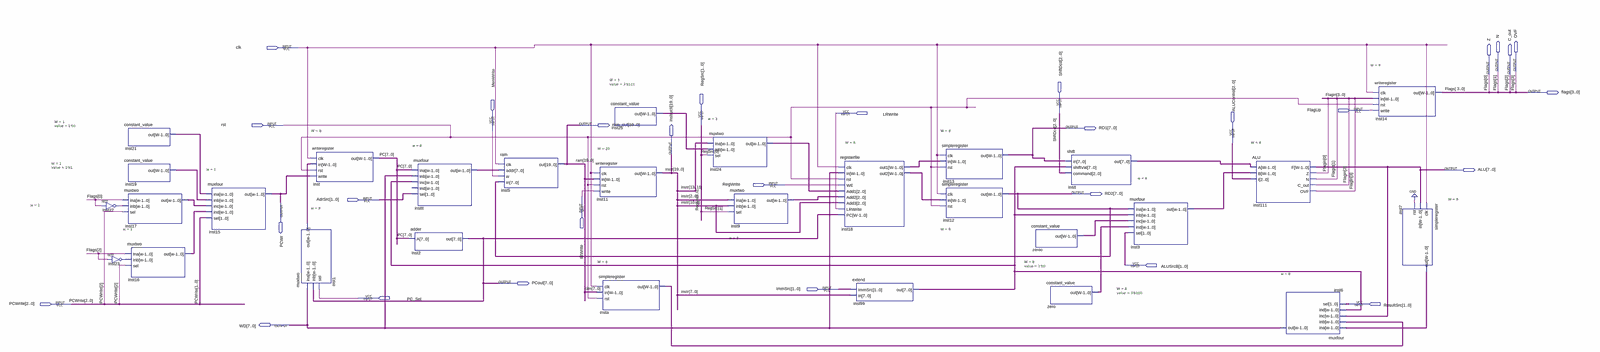
[diagram p0: schematic sheet, whole]
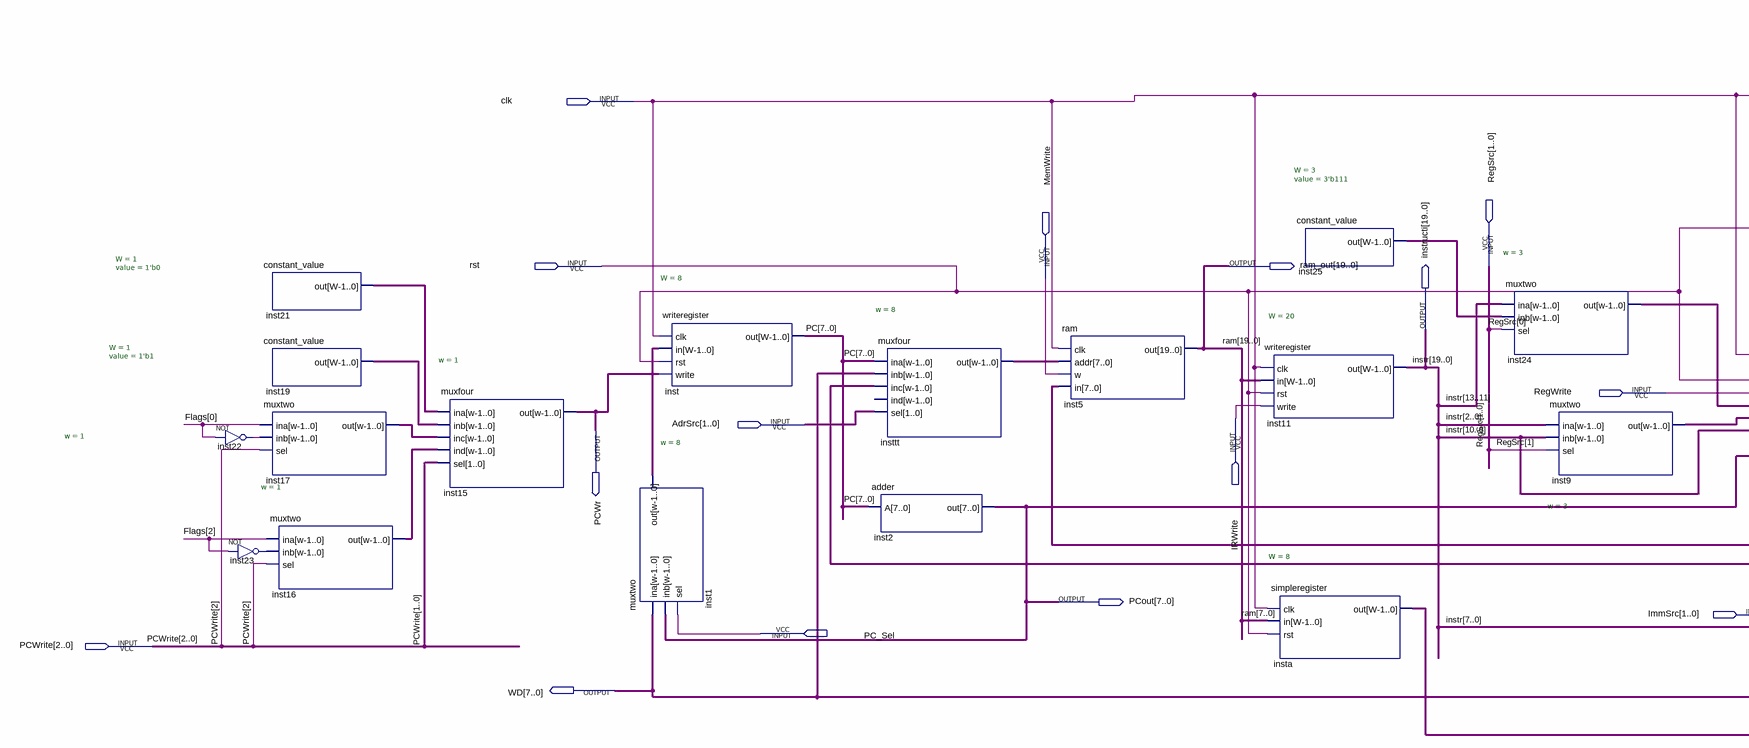
[diagram p1: schematic sheet, left part]
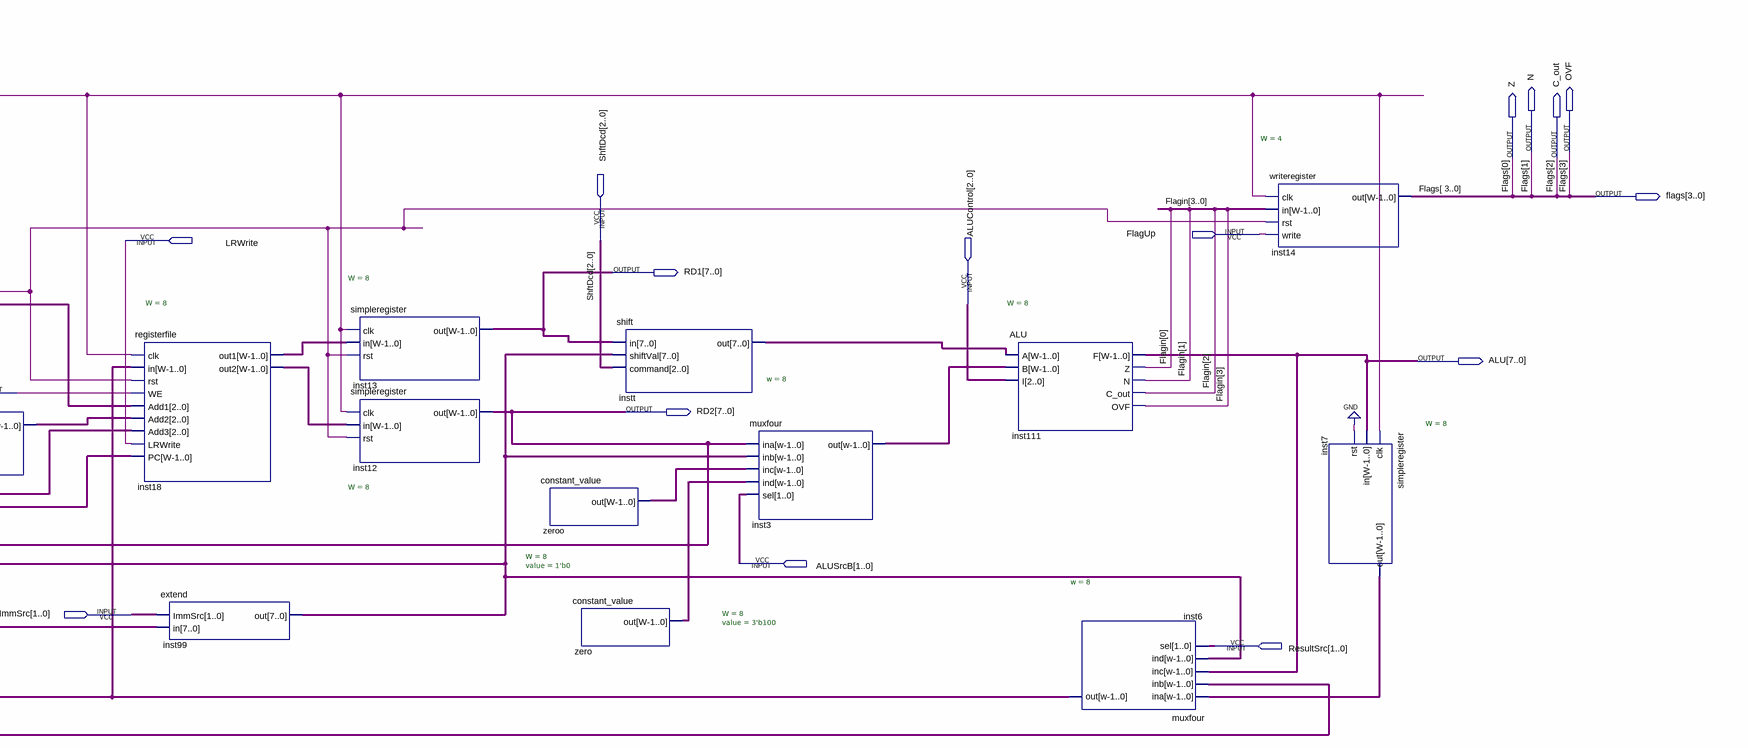
[diagram p2: schematic sheet, right part]
// Quartus schematic fourthData.bdf as structural Verilog: 29 symbols, 29 pins
module fourthData (
  input  clk,
  input  FlagUp,
  input  LRWrite,
  input  [2:0] ShftDcd,
  input  rst,
  input  [1:0] RegSrc,
  input  MemWrite,
  input  [2:0] ALUControl,
  input  RegWrite,
  input  IRWrite,
  input  [1:0] AdrSrc,
  input  [1:0] ALUSrcB,
  input  [1:0] ImmSrc,
  input  PC_Sel,
  input  [2:0] PCWrite,
  input  [1:0] ResultSrc,
  output N,
  output OVF,
  output Z,
  output C_out,
  output [3:0] flags,
  output [19:0] ram_out,
  output [7:0] RD1,
  output [19:0] instructi,
  output [7:0] ALU,
  output [7:0] RD2,
  output PCWr,
  output [7:0] PCout,
  output [7:0] WD
);

  wire inst16_out, inst17_out, inst19_out, inst21_out, inst22_out, inst23_out;
  wire [2:0] inst9_out, inst24_out, inst25_out;
  wire [3:0] Flagin;
  wire [7:0] inst1_out, inst3_out, inst7_out, inst18_out1, inst18_out2, inst99_out, insta_out, instt_out,
       insttt_out, PC, zero_out, zeroo_out;

  not inst22 (inst22_out, flags[0]);
  constant_value #(.W(1), .value(1'b0)) inst21 (.out(inst21_out));
  constant_value #(.W(1), .value(1'b1)) inst19 (.out(inst19_out));
  muxtwo #(.w(1)) inst17 (.ina(flags[0]), .inb(inst22_out), .sel(PCWrite[2]), .out(inst17_out));
  muxtwo #(.w(1)) inst16 (.ina(C_out), .inb(inst23_out), .sel(PCWrite[2]), .out(inst16_out));
  not inst23 (inst23_out, C_out);
  muxfour #(.w(1)) inst15 (
    .ina(inst21_out), .inb(inst19_out), .inc(inst17_out), .ind(inst16_out), .sel(PCWrite[1:0]), .out(PCWr));
  writeregister #(.W(8)) inst (.clk(clk), .in(inst1_out), .rst(rst), .write(PCWr), .out(PC));
  muxtwo #(.w(8)) inst1 (.ina(WD), .inb(PCout), .sel(PC_Sel), .out(inst1_out));
  muxfour #(.w(8)) insttt (.ina(PC), .inb(WD), .inc(inst99_out), .sel(AdrSrc), .out(insttt_out));  // open: ind
  adder inst2 (.A(PC), .out(PCout));
  ram inst5 (.clk(clk), .addr(insttt_out), .w(MemWrite), .in(RD2), .out(ram_out));
  writeregister #(.W(20)) inst11 (.clk(clk), .in(ram_out), .rst(rst), .write(IRWrite), .out(instructi));
  simpleregister #(.W(8)) insta (.clk(clk), .in(ram_out[7:0]), .rst(rst), .out(insta_out));
  constant_value #(.W(3), .value(3'b111)) inst25 (.out(inst25_out));
  muxtwo #(.w(3)) inst24 (.ina(instructi[13:11]), .inb(inst25_out), .sel(RegSrc[0]), .out(inst24_out));
  muxtwo #(.w(3)) inst9 (.ina(instructi[2:0]), .inb(instructi[10:8]), .sel(RegSrc[1]), .out(inst9_out));
  registerfile #(.W(8)) inst18 (
    .clk(clk), .in(WD), .rst(rst), .WE(RegWrite), .Add1(inst24_out), .Add2(inst9_out),
    .Add3(instructi[10:8]), .LRWrite(LRWrite), .PC(PCout), .out1(inst18_out1), .out2(inst18_out2));
  extend inst99 (.ImmSrc(ImmSrc), .in(instructi[7:0]), .out(inst99_out));
  simpleregister #(.W(8)) inst13 (.clk(clk), .in(inst18_out1), .rst(rst), .out(RD1));
  simpleregister #(.W(8)) inst12 (.clk(clk), .in(inst18_out2), .rst(rst), .out(RD2));
  constant_value #(.W(8), .value(1'b0)) zeroo (.out(zeroo_out));
  constant_value #(.W(8), .value(3'b100)) zero (.out(zero_out));
  shift instt (.in(RD1), .shiftVal(inst99_out), .command(ShftDcd), .out(instt_out));
  muxfour #(.w(8)) inst3 (.ina(RD2), .inb(inst99_out), .inc(zeroo_out), .ind(zero_out), .sel(ALUSrcB), .out(inst3_out));
  ALU #(.W(8)) inst111 (
    .A(instt_out), .B(inst3_out), .I(ALUControl), .F(ALU), .Z(Flagin[0]), .N(Flagin[1]), .C_out(Flagin[2]),
    .OVF(Flagin[3]));
  muxfour #(.w(8)) inst6 (.ina(inst7_out), .inb(insta_out), .inc(ALU), .ind(inst99_out), .sel(ResultSrc), .out(WD));
  writeregister #(.W(4)) inst14 (
    .clk(clk), .in(Flagin), .rst(rst), .write(FlagUp), .out({flags[3], C_out, flags[1:0]}));
  simpleregister #(.W(8)) inst7 (.clk(clk), .in(ALU), .rst(1'b0), .out(inst7_out));

  assign flags[2] = C_out;
  assign N = flags[1];
  assign OVF = flags[3];
  assign Z = flags[0];

  // Other names for the same wires on the sheet: instr[19:0] = instructi; ram[19:0] = ram_out
endmodule
